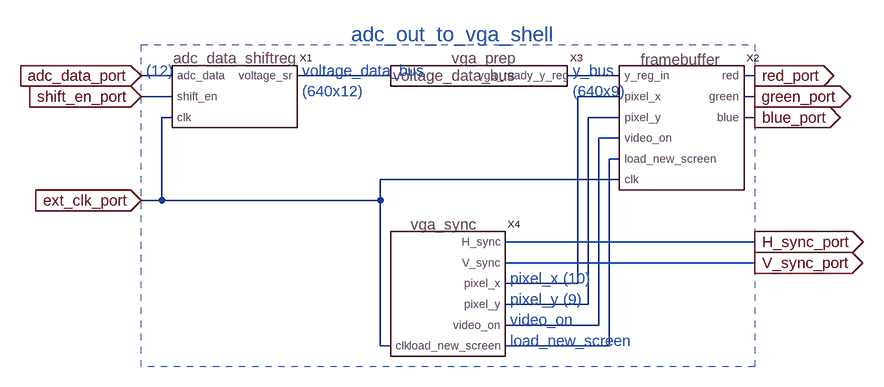
[diagram p0: schematic adc_out_to_vga_shell.asc]
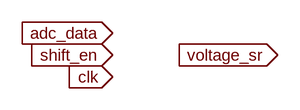
[diagram p1: sub-circuit adc_data_shiftreg.asc]
adc_out_to_vga_shell.asc, the LTspice schematic file:
Version 4
SHEET 1 936 680
WIRE -112 144 -160 144
WIRE 224 144 80 144
WIRE 576 144 496 144
WIRE 784 144 768 144
WIRE -112 176 -160 176
WIRE 576 176 512 176
WIRE 784 176 768 176
WIRE -112 208 -128 208
WIRE 576 208 528 208
WIRE 784 208 768 208
WIRE 576 240 544 240
WIRE 576 272 560 272
WIRE 576 304 208 304
WIRE -128 336 -128 208
WIRE -128 336 -160 336
WIRE 208 336 208 304
WIRE 208 336 -128 336
WIRE 784 400 400 400
WIRE 784 432 400 432
WIRE 512 464 512 176
WIRE 512 464 400 464
WIRE 528 496 528 208
WIRE 528 496 400 496
WIRE 544 528 544 240
WIRE 544 528 400 528
WIRE 208 560 208 336
WIRE 224 560 208 560
WIRE 560 560 560 272
WIRE 560 560 400 560
FLAG -160 336 ext_clk_port
IOPIN -160 336 In
FLAG -160 144 adc_data_port
IOPIN -160 144 In
FLAG -160 176 shift_en_port
IOPIN -160 176 In
FLAG 784 144 red_port
IOPIN 784 144 Out
FLAG 784 176 green_port
IOPIN 784 176 Out
FLAG 784 208 blue_port
IOPIN 784 208 Out
FLAG 784 400 H_sync_port
IOPIN 784 400 Out
FLAG 784 432 V_sync_port
IOPIN 784 432 Out
SYMBOL adc_data_shiftreg -16 176 R0
SYMATTR InstName X1
SYMBOL framebuffer 672 176 R0
SYMATTR InstName X2
SYMBOL vga_prep 368 144 R0
SYMATTR InstName X3
SYMBOL vga_sync 304 448 R0
SYMATTR InstName X4
TEXT 408 456 Left 2 ;pixel_x (10)
TEXT 408 488 Left 2 ;pixel_y (9)
TEXT 408 520 Left 2 ;video_on
TEXT 408 552 Left 2 ;load_new_screen
TEXT 88 136 Left 2 ;voltage_data_bus\n(640x12)
TEXT 504 136 Left 2 ;y_bus\n(640x9)
TEXT -152 136 Left 2 ;(12)
TEXT 320 80 Center 3 ;adc_out_to_vga_shell
RECTANGLE Normal 784 592 -160 96 2

adc_data_shiftreg.asc, the sub-circuit schematic file:
Version 4
SHEET 1 880 680
FLAG 160 224 clk
IOPIN 160 224 In
FLAG 160 160 adc_data
IOPIN 160 160 In
FLAG 160 192 shift_en
IOPIN 160 192 In
FLAG 256 192 voltage_sr
IOPIN 256 192 Out

The netlist it stands for:
* adc_out_to_vga_shell.asc
XX1 adc_data_port shift_en_port ext_clk_port N001 adc_data_shiftreg
XX2 N002 N003 N004 N005 N006 red_port green_port blue_port ext_clk_port framebuffer  ; pins y_reg_in pixel_x pixel_y video_on load_new_screen red green blue clk
XX3 N001 N002 vga_prep  ; pins V_data_bus vga_ready_y_reg
XX4 V_sync_port H_sync_port N003 N004 N005 N006 ext_clk_port vga_sync  ; pins V_sync H_sync pixel_x pixel_y video_on load_new_screen clk

* block symbol definitions
.subckt adc_data_shiftreg adc_data shift_en clk voltage_sr
.ends adc_data_shiftreg

* pixel_x (10)
* pixel_y (9)
* video_on
* load_new_screen
* voltage_data_bus
* (640x12)
* y_bus
* (640x9)
* (12)
* adc_out_to_vga_shell
.backanno
.end